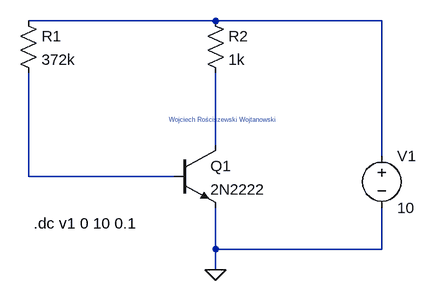
[diagram p0: schematic Static operating point of the transistor..asc]
Static operating point of the transistor..asc, the LTspice schematic file:
Version 4
SHEET 1 880 680
WIRE 224 16 -64 16
WIRE 480 16 224 16
WIRE 224 208 224 96
WIRE 480 224 480 16
WIRE -64 256 -64 96
WIRE 160 256 -64 256
WIRE 224 368 224 304
WIRE 480 368 480 304
WIRE 480 368 224 368
WIRE 224 400 224 368
FLAG 224 400 0
SYMBOL res -80 0 R0
SYMATTR InstName R1
SYMATTR Value 372k
SYMBOL res 208 0 R0
SYMATTR InstName R2
SYMATTR Value 1k
SYMBOL npn 160 208 R0
SYMATTR InstName Q1
SYMATTR Value 2N2222
SYMBOL voltage 480 208 R0
WINDOW 123 0 0 Left 0
WINDOW 39 0 0 Left 0
SYMATTR InstName V1
SYMATTR Value 10
TEXT 152 168 Left 0 ;Wojciech Rościszewski Wojtanowski
TEXT -56 328 Left 2 !.dc v1 0 10 0.1

The netlist it stands for:
* Static operating point of the transistor..asc
R1 N001 N003 372k
R2 N001 N002 1k
Q1 N002 N003 0 0 2N2222
V1 N001 0 10
.model NPN NPN
.model PNP PNP
.lib standard.bjt
* Wojciech Rościszewski Wojtanowski
.dc v1 0 10 0.1
.backanno
.end